# EAGLE design k1fm-pico-power (EAGLE 9.2.2)
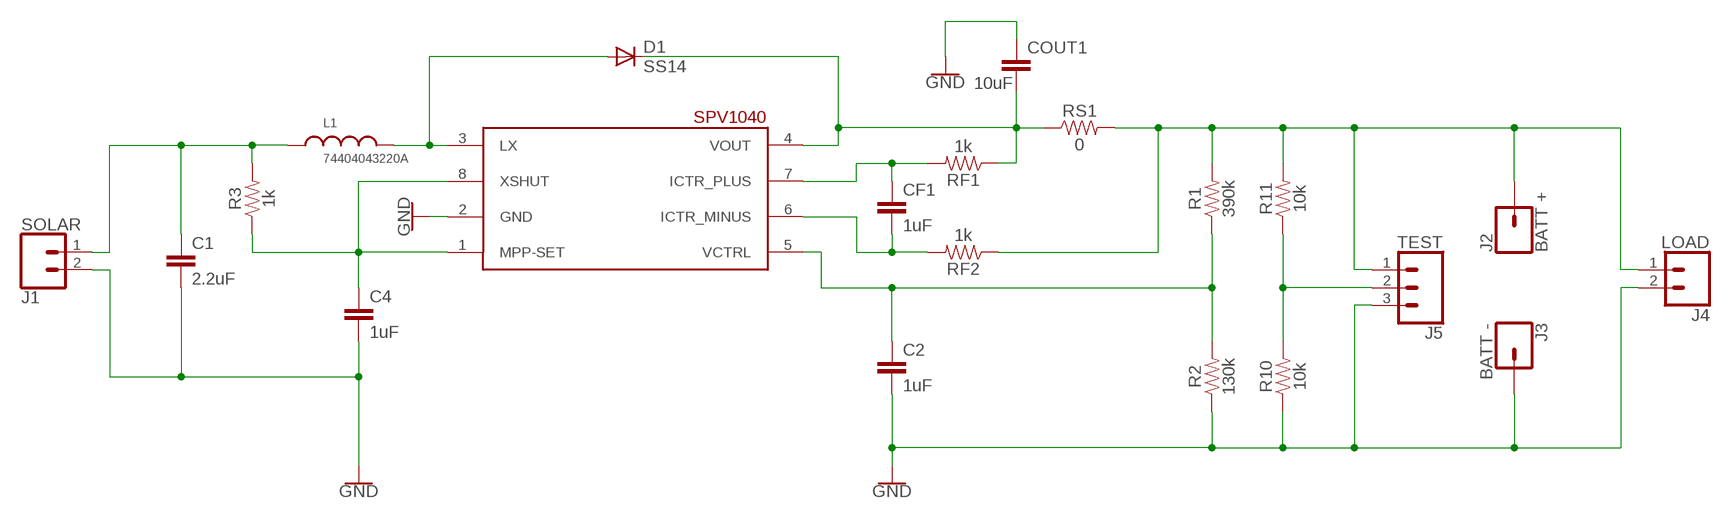
[diagram p0: schematic, sheet 1]

## Parts
C1  2.2uF  3.0NF-0603-50V-5%  [0603]
C2  1uF  3.0NF-0603-50V-5%  [0603]
C4  1uF  3.0NF-0603-50V-5%  [0603]
CF1  1uF  3.0NF-0603-50V-5%  [0603]
COUT1  10uF  3.0NF-0603-50V-5%  [0603]
D1  SS14  DIODE-DO-214AC  [DO-214AC]
J1  SOLAR  CONN_02  [1X02]
J2  BATT +  CONN_01  [1X01]
J3  BATT -  CONN_01  [1X01]
J4  LOAD  CONN_02  [1X02]
J5  TEST  CONN_03  [1X03]
L1  74404043220A  WE-LQS_4025_74404043220A  [WE-LQS_4025]
R1  390k  390KOHM-0603-1/10W-1%  [0603]
R2  130k  150KOHM-0603-1/10W-1%  [0603]
R3  1k  1KOHM-0603-1/10W-1%  [0603]
R10  10k  150KOHM-0603-1/10W-1%  [0603]
R11  10k  150KOHM-0603-1/10W-1%  [0603]
RF1  1k  1KOHM-0603-1/10W-1%  [0603]
RF2  1k  1KOHM-0603-1/10W-1%  [0603]
RS1  0  1KOHM-0603-1/10W-1%  [0603]
U1  SPV1040  [TSSOP-8]

## Nets
GND: C1.2 C2.2 C4.2 COUT1.1 J1.2 J3.1 J4.2 J5.3 R2.1 R10.1 U1.2(GND)
N$1: D1.A L1.2 U1.3(LX)
N$2: C1.1 J1.1 L1.1 R3.2
N$3: C4.1 R3.1 U1.1(MPP-SET) U1.8(XSHUT)
N$4: J2.1 J4.1 J5.1 R1.2 R11.2 RF2.1 RS1.2
N$5: J5.2 R10.2 R11.1
N$6: CF1.1 RF1.2 U1.7(ICTR_PLUS)
N$7: C2.1 R1.1 R2.2 U1.5(VCTRL)
N$8: COUT1.2 D1.C RF1.1 RS1.1 U1.4(VOUT)
N$9: CF1.2 RF2.2 U1.6(ICTR_MINUS)

## Library data of the parts
C1 C2 C4 CF1 COUT1 = SparkFun-Capacitors:3.0NF: 3.0nF (3nF, 3000pF) ceramic capacitors A capacitor is a passive two-terminal electrical component used to store electrical energy temporarily in an electric field.; PROD_ID: CAP-13515; VALUE: 3.0nF
D1 = diode:DIODE-: DIODE
J1 J4 = SparkFun-Connectors:CONN_02: Multi connection point. Often used as Generic Header-pin footprint for 0.1 inch spaced/style header connections On any of the 0.1 inch spaced packages, you can populate with these: Break Away Headers - Straight <https://www.sparkfun.com/products/116> (PRT-00116) Break Away Male Headers - Right Angle <https://www.sparkfun.com/products/553> (PRT-00553) Female Headers <https://www.sparkfun.com/products/115> (PRT-00115) Break Away Headers - Machine Pin <https://www.sparkfun.com/products/117> (PRT-00117) Break Away Female Headers - Swiss Machine Pin <https://www.sparkfun.com/products/743> (PRT-00743) For SCREWTERMINALS and SPRING TERMINALS visit here: Screw Terimnals on SparkFun.com <https://www.sparkfun.com/search/results?term=Screw+Terminals> (5mm/3.5mm/2.54mm spacing) This device is also useful as a general connection point to wire up your design to another part of your project. Our various solder wires solder well into these plated through hole pads. Hook-Up Wire - Assortment (Stranded, 22 AWG) <https://www.sparkfun.com/products/11375> (PRT-11375) Hook-Up Wire - Assortment (Solid Core, 22 AWG) <https://www.sparkfun.com/products/11367> (PRT-11367) View the entire wire category on our website here <https://www.sparkfun.com/categories/141> Special notes: Molex polarized connector foot print use with: PRT-08233 with associated crimp pins and housings. 2.54_SCREWTERM for use with PRT-10571. 3.5mm Screw Terminal footprints for PRT-08084 5mm Screw Terminal footprints for use with PRT-08432
J2 J3 = SparkFun-Connectors:CONN_01: Single connection point. Often used as Generic Header-pin footprint for 0.1 inch spaced/style header connections On any of the 0.1 inch spaced packages, you can populate with these: Break Away Headers - Straight <https://www.sparkfun.com/products/116> (PRT-00116) Break Away Male Headers - Right Angle <https://www.sparkfun.com/products/553> (PRT-00553) Female Headers <https://www.sparkfun.com/products/115> (PRT-00115) Break Away Headers - Machine Pin <https://www.sparkfun.com/products/117> (PRT-00117) Break Away Female Headers - Swiss Machine Pin <https://www.sparkfun.com/products/743> (PRT-00743) This device is also useful as a general connection point to wire up your design to another part of your project. Our various solder wires solder well into these plated through hole pads. Hook-Up Wire - Assortment (Stranded, 22 AWG) <https://www.sparkfun.com/products/11375> (PRT-11375) Hook-Up Wire - Assortment (Solid Core, 22 AWG) <https://www.sparkfun.com/products/11367> (PRT-11367) View the entire wire category on our website here <https://www.sparkfun.com/categories/141> Special notes: SMTSO-256-ET is a "flush mount" nut for a 4-40 screw. We mostly use this on specialty testbeds; it is a nice way to connect hardware to your PCB at an adjustable hieght. Also note, the SNAP packages are for using a snappable style connector. We sell a baggie of snaps and they are also used on two LilyPad designs: Snap Assortment - 30 pack (male and female) <https://www.sparkfun.com/products/11347> (DEV-11347) LilyPad Arduino SimpleSnap <https://www.sparkfun.com/products/10941> (DEV-10941) LilyPad SimpleSnap Protoboard <https://www.sparkfun.com/products/10940> (DEV-10940)
J5 = SparkFun-Connectors:CONN_03: Multi connection point. Often used as Generic Header-pin footprint for 0.1 inch spaced/style header connections On any of the 0.1 inch spaced packages, you can populate with these: Break Away Headers - Straight <https://www.sparkfun.com/products/116> (PRT-00116) Break Away Male Headers - Right Angle <https://www.sparkfun.com/products/553> (PRT-00553) Female Headers <https://www.sparkfun.com/products/115> (PRT-00115) Break Away Headers - Machine Pin <https://www.sparkfun.com/products/117> (PRT-00117) Break Away Female Headers - Swiss Machine Pin <https://www.sparkfun.com/products/743> (PRT-00743) Stackable Header - 3 Pin (Female, 0.1") <https://www.sparkfun.com/products/13875> (PRT-13875) For SCREWTERMINALS and SPRING TERMINALS visit here: Screw Terimnals on SparkFun.com <https://www.sparkfun.com/search/results?term=Screw+Terminals> (5mm/3.5mm/2.54mm spacing) This device is also useful as a general connection point to wire up your design to another part of your project. Our various solder wires solder well into these plated through hole pads. Hook-Up Wire - Assortment (Stranded, 22 AWG) <https://www.sparkfun.com/products/11375> (PRT-11375) Hook-Up Wire - Assortment (Solid Core, 22 AWG) <https://www.sparkfun.com/products/11367> (PRT-11367) View the entire wire category on our website here <https://www.sparkfun.com/categories/141> Special notes: Molex polarized connector foot print use with SKU : PRT-08232 with associated crimp pins and housings.
L1 = PowerMagnetics (rev18e):WE-LQS_4025: SMD Shielded Tiny Power Inductor Characteristics Tiny Power Inductor design 1.7 times more current in comparison with unshielded versions Robust design & high durability Low RDC Magnetically shielded with magnetic glue reducing buzz noise in ultra-low levels Operating Temperature: –40 °C to +125 °C Applications Integrated DC/DC Converters Switching controllers which required high efficiency Portable power (Smartphones, digital cameras, Tablets, etc.) Embedded laptops and PCs Big sizes (5040, 60xx, 8040) used for shock-proof circuits <http://katalog.we-online.de/media/images/v2/Family_WE-LQS.jpg> Details see: http://katalog.we-online.de/en/pbs/WE-LQS Created by Dan Xu 2014-05-21 2014 (C) Wurth Elektronik; WE-NUMBER: 74404043220A/22uH
R1 = SparkFun-Resistors:390KOHM: 390kΩ resistor A resistor is a passive two-terminal electrical component that implements electrical resistance as a circuit element. Resistors act to reduce current flow, and, at the same time, act to lower voltage levels within circuits. - Wikipedia; PROD_ID: RES-12024
R2 R10 R11 = SparkFun-Resistors:150KOHM: 150kΩ resistor A resistor is a passive two-terminal electrical component that implements electrical resistance as a circuit element. Resistors act to reduce current flow, and, at the same time, act to lower voltage levels within circuits. - Wikipedia; PROD_ID: RES-09117; VALUE: 150k
R3 RF1 RF2 = SparkFun-Resistors:1KOHM: 1kΩ resistor A resistor is a passive two-terminal electrical component that implements electrical resistance as a circuit element. Resistors act to reduce current flow, and, at the same time, act to lower voltage levels within circuits. - Wikipedia; PROD_ID: RES-07856
RS1 = SparkFun-Resistors:1KOHM: 1kΩ resistor A resistor is a passive two-terminal electrical component that implements electrical resistance as a circuit element. Resistors act to reduce current flow, and, at the same time, act to lower voltage levels within circuits. - Wikipedia; PROD_ID: RES-07856; VALUE: 1k
U1 = smd-footprints:SPV1040

## Board
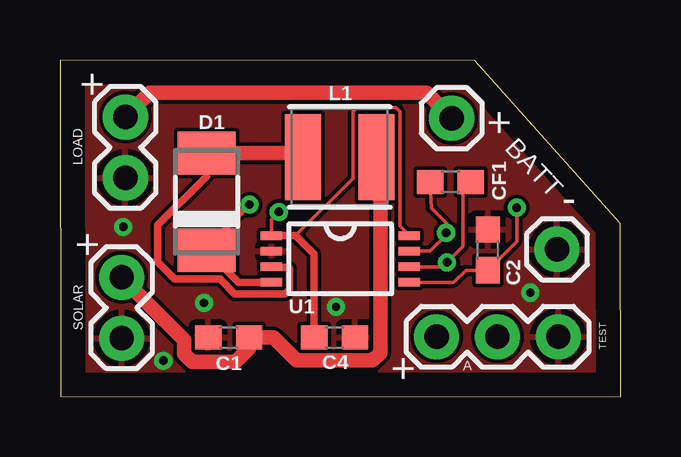
[diagram p1: board, top side]
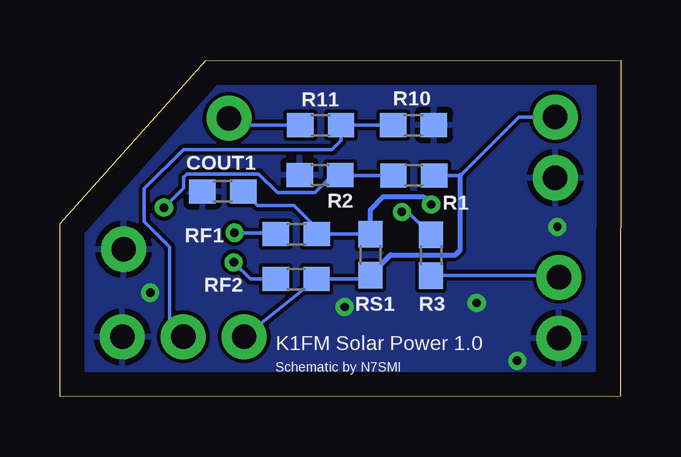
[diagram p2: board, bottom side, seen from below]

Size 23.38 x 14.05 mm. Coordinates in mm from the lower left corner, seen from the top.
Outline: 0.02,0.01 23.38,0 23.37,7.22 17.3,14.01 0,14.05 0.02,0.01
Copper layers (1+2*15+16): Top 0.035mm / dielectric 1.5mm / layer 2 0.035mm / dielectric 0.15mm / layer 15 0.035mm / dielectric 0.2mm / Bottom 0.035mm
Design rules "default *": minimum track width 6mil, minimum drill 0.35mm, track to track 6mil, track to pad 6mil, pad to pad 6mil, via to via 6mil, smd to smd 6mil, copper to edge 40mil, drill to drill 6mil, minimum pad ring 10mil, minimum via ring 8mil, stop-mask expansion 4mil, vias tented up to drill 0mil, thermal gap 10mil

### Footprints (pad centres in the part's own frame; a part is rotated, then mirrored left to right if it is on the bottom)
0603 = smd 1.1 x 1: 1 -0.85,0; 2 0.85,0
DO-214AC = smd 1.8 x 2.4: A 2.025,0; C -2.025,0
1X02 = drill 1.016 pad 1.88: 1 0,0; 2 2.54,0
1X01 = drill 1.016 pad 1.88: 1 0,0
1X03 = drill 1.016 pad 1.88: 1 0,0; 2 2.54,0; 3 5.08,0
WE-LQS_4025 = smd 1.5 x 3.6: 1 -1.525,0; 2 1.525,0
TSSOP-8 = smd 0.9 x 0.35: 1 -2.875,0.975; 2 -2.875,0.325; 3 -2.875,-0.325; 4 -2.875,-0.975; 5 2.875,-0.975; 6 2.875,-0.325; 7 2.875,0.325; 8 2.875,0.975

### Placement (x,y rotation side)
C1  7.03,2.47 180 top
C2  17.84,6.12 90 top
C4  11.45,2.47 0 top
CF1  16.28,8.96 0 top
COUT1  16.59,8.56 0 bottom
D1  6.12,8.14 90 top
J1  2.57,4.98 270 top
J2  16.33,11.62 0 top
J3  20.72,6.15 0 top
J4  2.73,11.67 270 top
J5  15.7,2.5 0 top
L1  11.66,10 180 top
R1  8.62,9.23 0 bottom
R2  12.54,9.24 0 bottom
R3  7.91,5.9 270 bottom
R10  8.64,11.33 180 bottom
R11  12.51,11.32 180 bottom
RF1  13.53,6.79 180 bottom
RF2  13.53,4.91 180 bottom
RS1  10.44,5.92 270 bottom
U1  11.69,5.75 0 top

### Tracks (layer width: path | path; a pad name or v marks a point on that pad's centre or on a via)
GND  (via drill 0.35)
  other vias: 4.31,1.5 6.01,3.91 11.51,3.75 2.64,7.08 19.61,4.34
  pour Bottom: 0.13,13.91 17.17,13.88 23.25,7.1 23.27,0.05 0.17,0.11 0.15,13.88
  pour Top: 0.17,13.91 17.19,13.84 23.2,7.15 23.18,0.09 0.13,0.11
N$1
  Top 0.152: 8.84,5.4 U1.3
  Top 0.305: 8.84,5.4 9.52,5.4 9.57,5.36 9.57,5.07 9.57,4.47 9.39,4.29 7.29,4.29 6.67,4.91 4.79,4.91 4.08,5.61 4.08,7.15 6.12,9.19 D1.A
  Top 0.61: D1.A 9.97,10.16 L1.2
N$2
  Top 0.61: L1.1 13.19,9.85 13.36,9.68 13.36,1.83 13.04,1.51 9.86,1.51 8.9,2.47 C1.1 7.88,2.02 7.32,1.46 5.5,1.46 5.18,1.78 5.18,2.37 J1.1
  Bottom 0.152: J1.1 2.65,5.05 R3.2
N$3  (via drill 0.35)
  Top 0.152: U1.8 14.17,7.12 14.17,11.89 14,12.06 12.38,12.06 12.21,11.89 12.21,9.11 9.82,6.72 | U1.1 8.81,7.4 v9.13,7.71
  Top 0.305: C4.1 10.6,5.94 9.82,6.72 U1.1
  Bottom 0.152: v9.13,7.71 8.87,7.71 R3.1
N$4
  Top 0.61: J4.1 3.74,12.68 15.27,12.68 J2.1
  Bottom 0.152: RF2.1 10.6,4.91 RS1.2 10.07,5.07 | R11.2 16.04,11.32 J2.1 | 12.73,4.86 RF2.1 | J4.1 4.24,11.67 6.68,9.23 R1.2 | RF2.1 J5.1
  Bottom 0.2: RS1.2 9.59,5.92 6.89,5.92 6.68,6.13 6.68,9.23
N$5
  Bottom 0.152: R10.2 9.5,11.32 R11.1 11.66,10.68 12.03,10.31 18.23,10.31 19.87,8.67 19.87,7.3 18.81,6.24 18.81,3.07 J5.2
N$6  (via drill 0.35)
  Top 0.152: U1.7 15.43,6.07 16.11,6.75 v16.11,6.84 16.11,7.25 15.49,7.87 CF1.1
  Bottom 0.152: v16.11,6.84 14.43,6.84 RF1.2
N$7  (via drill 0.35)
  Top 0.152: U1.5 16.41,4.77 16.92,5.27 C2.1 19.05,6.49 v19.05,7.89
  Top 0.2: 18.24,5.27 C2.1
  Bottom 0.152: R1.1 11.68,9.23 R2.2 12.01,9.24 12.74,8.51 14.31,8.51 15.1,9.29 18.08,9.29 18.22,9.16 18.22,8.71 v19.04,7.89 v19.05,7.89
N$8  (via drill 0.35)
  Top 0.2: v7.9,8.01 6.12,6.23 D1.C
  Top 0.305: U1.4 7.45,4.77 D1.C
  Bottom 0.152: RS1.1 10.46,6.79 RF1.1 12.67,7.03 13.62,7.97 15.15,7.97 COUT1.2
  Bottom 0.2: RS1.1 10.44,7.8 9.89,8.34 8.22,8.34 v7.9,8.01
N$9  (via drill 0.35)
  Top 0.152: U1.6 15.96,5.42 v16.14,5.6 16.81,6.27 16.81,8.64 CF1.2
  Bottom 0.152: v16.14,5.6 15.44,4.91 RF2.2

### Text on the board
tNames: + | + | LOAD | BATT | - | + | SOLAR | TEST | A | +
bNames: K1FM Solar Power 1.0 | Schematic by N7SMI